# EAGLE schematic Schematic (EAGLE 9.6.2)
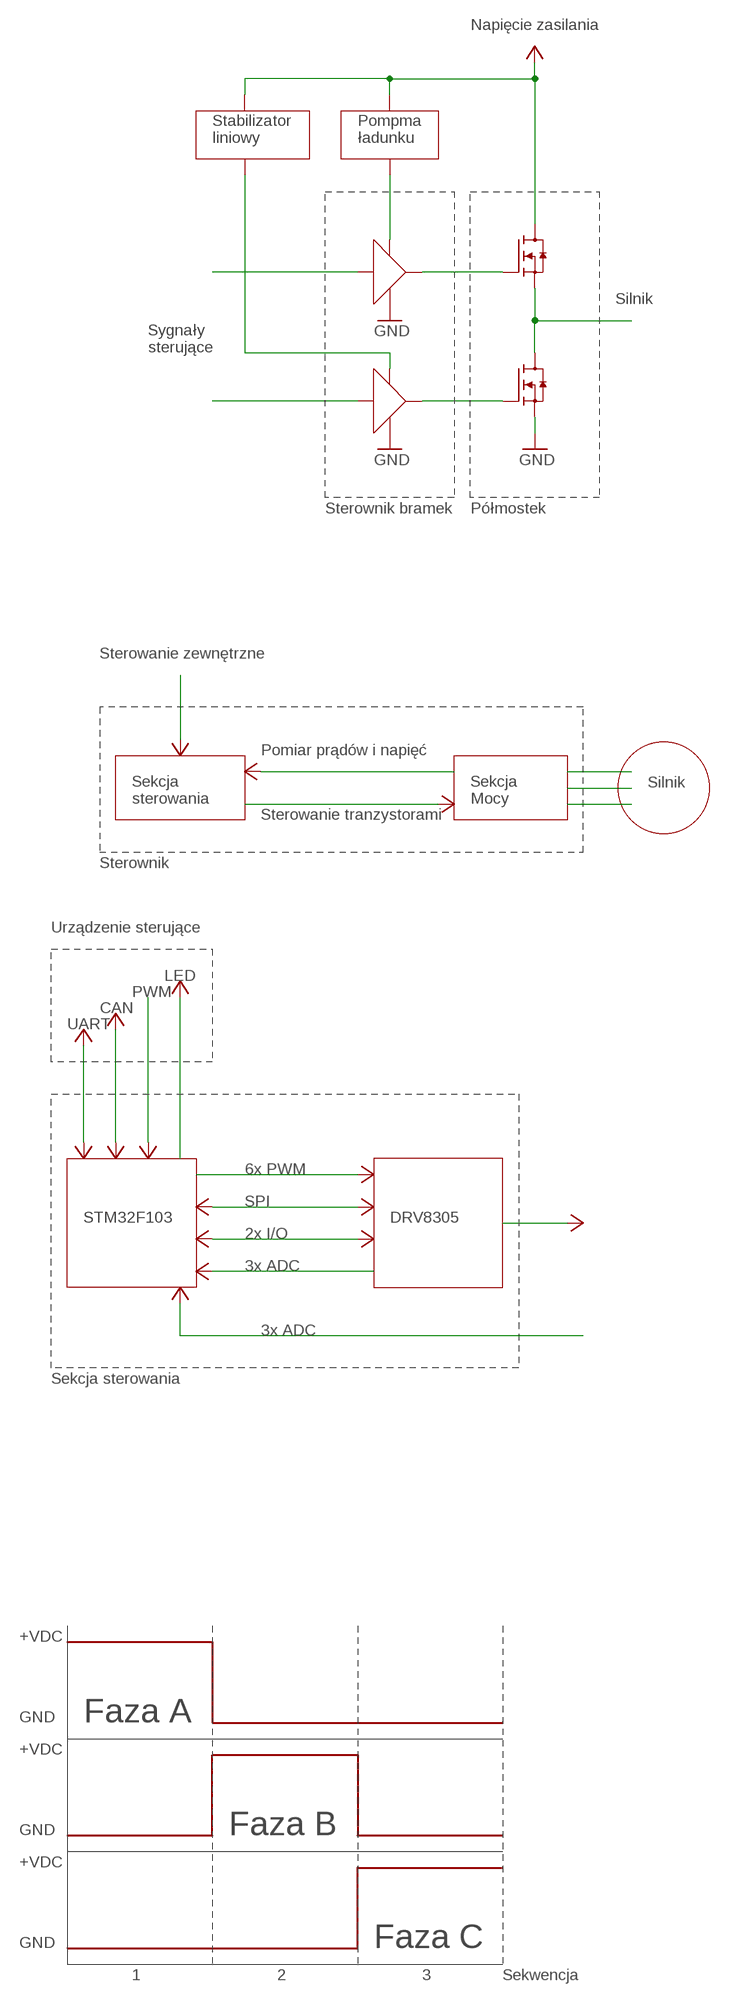
[diagram p0: schematic, sheet 1, part 1 of 3]
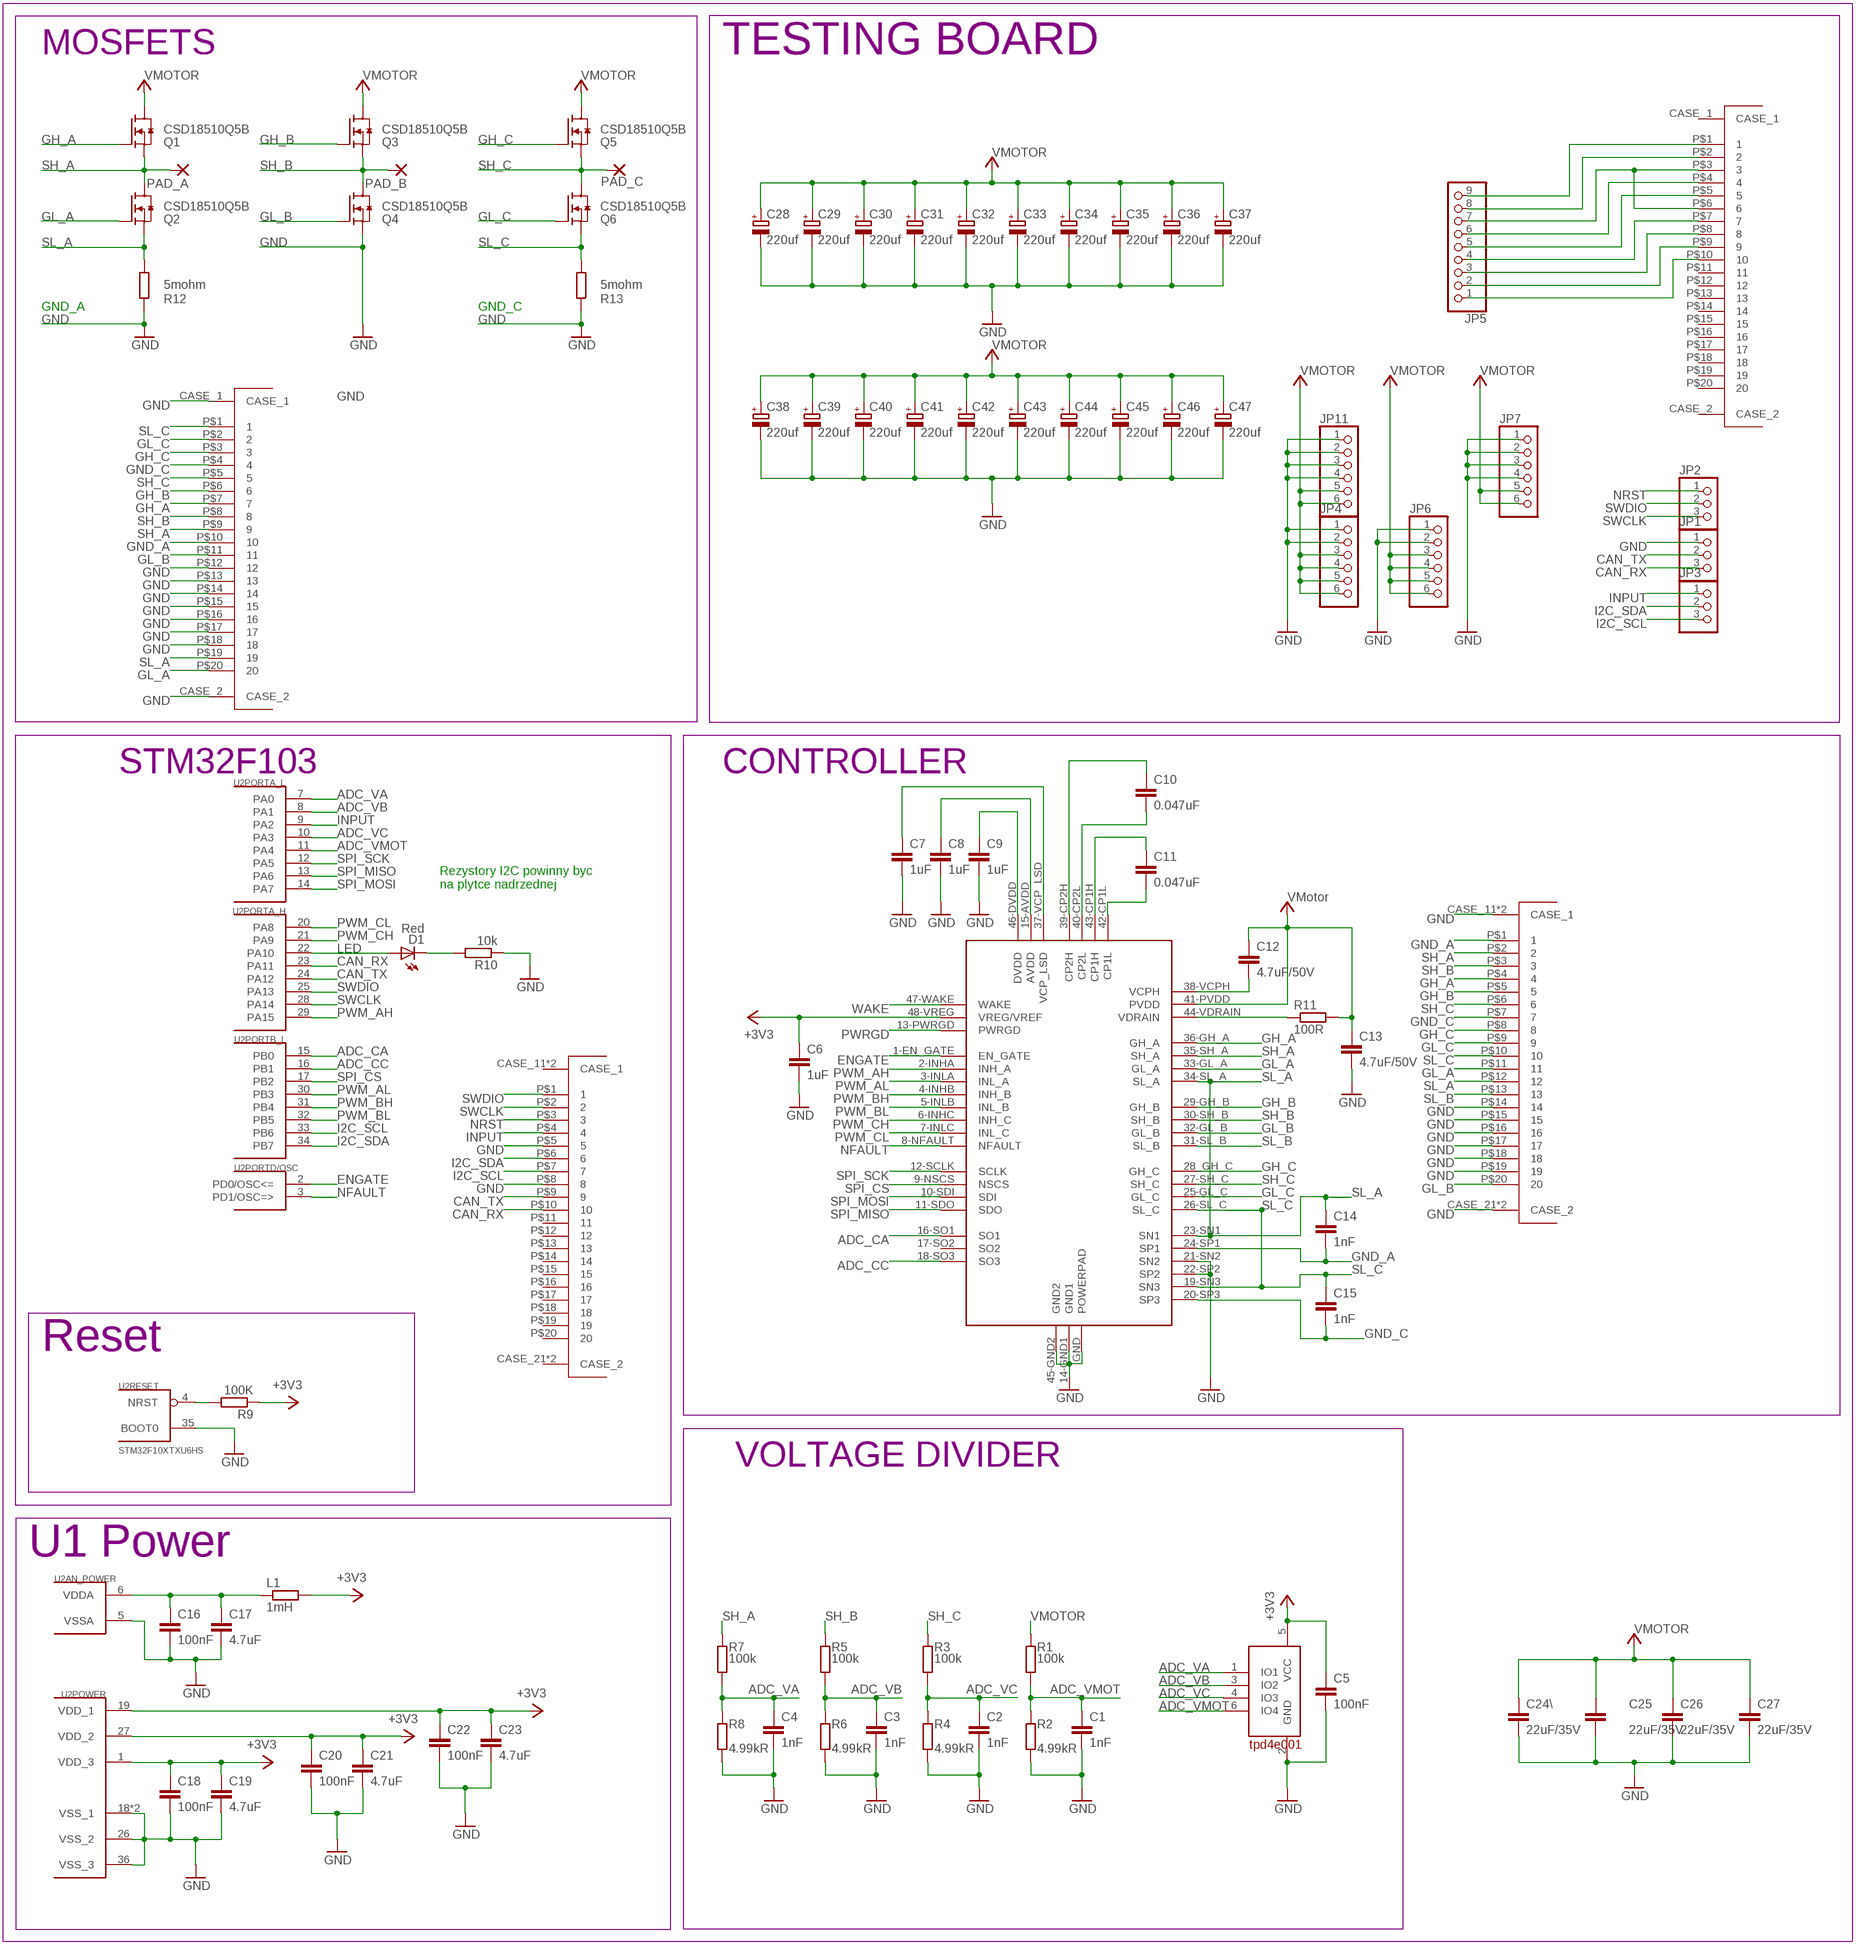
[diagram p1: schematic, sheet 1, part 2 of 3]
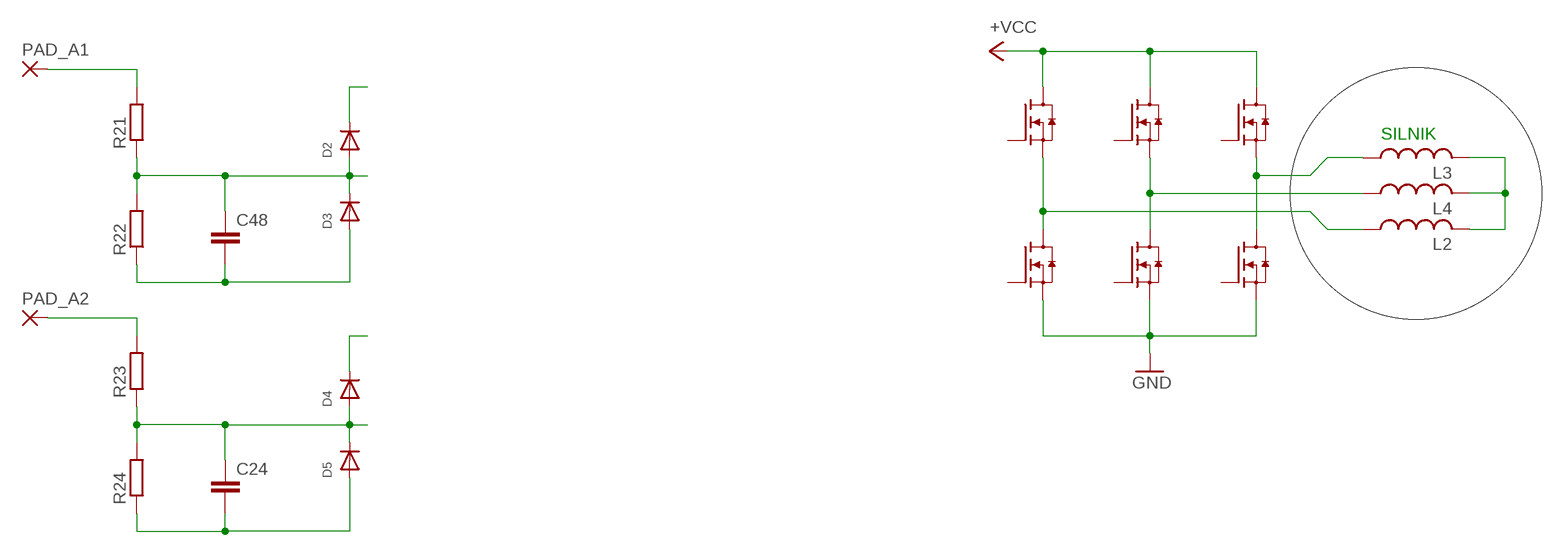
[diagram p2: schematic, sheet 1, part 3 of 3]

## Parts
C1  1nF  C-EU  [R0402]
C2  1nF  C-EU  [R0402]
C3  1nF  C-EU  [R0402]
C4  1nF  C-EU  [R0402]
C5  100nF  C-EU  [R0402]
C6  1uF  C-EU  [R0402]
C7  1uF  C-EU  [R0402]
C8  1uF  C-EU  [R0402]
C9  1uF  C-EU  [R0402]
C10  0.047uF  C-EU  [R0402]
C11  0.047uF  C-EU  [R0402]
C12  4.7uF/50V  C-EUC0805  [C0805]
C13  4.7uF/50V  C-EUC0805  [C0805]
C14  1nF  C-EU  [R0402]
C15  1nF  C-EU  [R0402]
C16  100nF  C-EU  [R0402]
C17  4.7uF  C-EU  [R0402]
C18  100nF  C-EU  [R0402]
C19  4.7uF  C-EU  [R0402]
C20  100nF  C-EU  [R0402]
C21  4.7uF  C-EU  [R0402]
C22  100nF  C-EU  [R0402]
C23  4.7uF  C-EU  [R0402]
C24  C-EU025-040X050  [C025-040X050]
C24\  22uF/35V  C-EUC1206  [C1206]
C25  22uF/35V  C-EUC1206  [C1206]
C26  22uF/35V  C-EUC1206  [C1206]
C27  22uF/35V  C-EUC1206  [C1206]
C28  220uf  CPOL-EU150CLZ-0810  [150CLZ-0810]
C29  220uf  CPOL-EU150CLZ-0810  [150CLZ-0810]
C30  220uf  CPOL-EU150CLZ-0810  [150CLZ-0810]
C31  220uf  CPOL-EU150CLZ-0810  [150CLZ-0810]
C32  220uf  CPOL-EU150CLZ-0810  [150CLZ-0810]
C33  220uf  CPOL-EU150CLZ-0810  [150CLZ-0810]
C34  220uf  CPOL-EU150CLZ-0810  [150CLZ-0810]
C35  220uf  CPOL-EU150CLZ-0810  [150CLZ-0810]
C36  220uf  CPOL-EU150CLZ-0810  [150CLZ-0810]
C37  220uf  CPOL-EU150CLZ-0810  [150CLZ-0810]
C38  220uf  CPOL-EU150CLZ-0810  [150CLZ-0810]
C39  220uf  CPOL-EU150CLZ-0810  [150CLZ-0810]
C40  220uf  CPOL-EU150CLZ-0810  [150CLZ-0810]
C41  220uf  CPOL-EU150CLZ-0810  [150CLZ-0810]
C42  220uf  CPOL-EU150CLZ-0810  [150CLZ-0810]
C43  220uf  CPOL-EU150CLZ-0810  [150CLZ-0810]
C44  220uf  CPOL-EU150CLZ-0810  [150CLZ-0810]
C45  220uf  CPOL-EU150CLZ-0810  [150CLZ-0810]
C46  220uf  CPOL-EU150CLZ-0810  [150CLZ-0810]
C47  220uf  CPOL-EU150CLZ-0810  [150CLZ-0810]
C48  C-EU025-040X050  [C025-040X050]
D1  Red  LEDSML0603  [SML0603]
D2  DIODE_SOD-123FL  [SOD-123FL]
D3  DIODE_SOD-123FL  [SOD-123FL]
D4  DIODE_SOD-123FL  [SOD-123FL]
D5  DIODE_SOD-123FL  [SOD-123FL]
JP1  PINHD-1X3  [1X03]
JP2  PINHD-1X3  [1X03]
JP3  PINHD-1X3  [1X03]
JP4  PINHD-1X6  [1X06]
JP5  PINHD-1X9  [1X09-BIG]
JP6  PINHD-1X6  [1X06]
JP7  PINHD-1X6  [1X06]
JP11  PINHD-1X6  [1X06]
L1  1mH  R-EU_R0603  [R0603]
L2  L-US0204/5  [0204/5]
L3  L-US0204/5  [0204/5]
L4  L-US0204/5  [0204/5]
PAD_A  SMD5  [SMD2,54-5,08]
PAD_A1  SMD5  [SMD2,54-5,08]
PAD_A2  SMD5  [SMD2,54-5,08]
PAD_B  SMD5  [SMD2,54-5,08]
PAD_C  SMD5  [SMD2,54-5,08]
Q1  CSD17573Q5B  [Q5B]
Q2  CSD17573Q5B  [Q5B]
Q3  CSD17573Q5B  [Q5B]
Q4  CSD17573Q5B  [Q5B]
Q5  CSD17573Q5B  [Q5B]
Q6  CSD17573Q5B  [Q5B]
Q7  CSD17573Q5B  [Q5B]
Q8  CSD17573Q5B  [Q5B]
Q9  CSD17573Q5B  [Q5B]
Q10  CSD17573Q5B  [Q5B]
Q11  CSD17573Q5B  [Q5B]
Q12  CSD17573Q5B  [Q5B]
Q13  CSD17573Q5B  [Q5B]
Q14  CSD17573Q5B  [Q5B]
R1  100k  R-EU_R0402  [R0402]
R2  4.99kR  R-EU_R0402  [R0402]
R3  100k  R-EU_R0402  [R0402]
R4  4.99kR  R-EU_R0402  [R0402]
R5  100k  R-EU_R0402  [R0402]
R6  4.99kR  R-EU_R0402  [R0402]
R7  100k  R-EU_R0402  [R0402]
R8  4.99kR  R-EU_R0402  [R0402]
R9  100K  R-EU_R0402  [R0402]
R10  10k  R-EU_R0402  [R0402]
R11  100R  R-EU_R0603  [R0603]
R12  5mohm  R-EU_R2512  [R2512]
R13  5mohm  R-EU_R2512  [R2512]
R21  R-EU_0204/5  [0204/5]
R22  R-EU_0204/5  [0204/5]
R23  R-EU_0204/5  [0204/5]
R24  R-EU_0204/5  [0204/5]
U2  STM32F10XTXU6HS  [VFQFPN36-HS]
U$1  RECEPTACLE_20_0.4_5024262030  [RECEPTACLE_20_0.4_5024262030]
U$2  PLUG_20_0.4_5024302012  [PLUG_20_0.4_5024302012]
U$21  DRV8305  [S-PQFP-G48]
U$30  PLUG_20_0.4_5024302012  [PLUG_20_0.4_5024302012]
U$31  TPD4E001  [SOT-23]
U$32  RECEPTACLE_20_0.4_5024262030  [RECEPTACLE_20_0.4_5024262030]

## Nets
+3V3: C5.1 C6.1 C18.1 C19.1 C20.1 C21.1 C22.1 C23.1 L1.2 R9.1 U2.1(POWER:VDD_3) U2.19(POWER:VDD_1) U2.27(POWER:VDD_2) U$21.48-VREG(VREG/VREF) U$31.5(VCC)
+VCC: Q9.D Q10.D Q11.D ; supply symbol labelled VMotor
ADC_CA: U2.15(PORTB_L:PB0) U$21.16-SO1(SO1)
ADC_CC: U2.16(PORTB_L:PB1) U$21.18-SO3(SO3)
ADC_VA: C4.1 R7.1 R8.2 U2.7(PORTA_L:PA0) U$31.1(IO1)
ADC_VB: C3.1 R5.1 R6.2 U2.8(PORTA_L:PA1) U$31.3(IO2)
ADC_VC: C2.1 R3.1 R4.2 U2.10(PORTA_L:PA3) U$31.4(IO3)
ADC_VMOT: C1.1 R1.1 R2.2 U2.11(PORTA_L:PA4) U$31.6(IO4)
CAN_RX: JP1.3 U2.23(PORTA_H:PA11) U$1.P$10
CAN_TX: JP1.2 U2.24(PORTA_H:PA12) U$1.P$9
ENGATE: U2.2(PORTD/OSC:PD0/OSC<=) U$21.1-EN_GATE(EN_GATE)
GH_A: Q1.G U$21.36-GH_A(GH_A) U$30.P$7 U$32.P$4
GH_B: Q3.G U$21.29-GH_B(GH_B) U$30.P$6 U$32.P$5
GH_C: Q5.G U$21.28_GH_C(GH_C) U$30.P$3 U$32.P$8
GL_A: Q2.G U$21.33-GL_A(GL_A) U$30.P$20 U$32.P$11
GL_B: Q4.G U$21.32-GL_B(GL_B) U$30.P$11 U$32.P$20
GL_C: Q6.G U$21.25-GL_C(GL_C) U$30.P$2 U$32.P$9
GND: C1.2 C2.2 C3.2 C4.2 C5.2 C6.2 C7.2 C8.2 C9.2 C13.2 C16.2 C17.2 C18.2 C19.2 C20.2 C21.2 C22.2 C23.2 C24\.2 C25.2 C26.2 C27.2 C28.- C29.- C30.- C31.- C32.- C33.- C34.- C35.- C36.- C37.- C38.- C39.- C40.- C41.- C42.- C43.- C44.- C45.- C46.- C47.- JP1.1 JP4.1 JP4.2 JP6.1 JP6.2 JP7.1 JP7.2 JP7.3 JP7.4 JP11.1 JP11.2 JP11.3 JP11.4 Q4.S Q8.S Q12.S Q13.S Q14.S R2.1 R4.1 R6.1 R8.1 R10.1 R12.1 R13.1 U2.5(AN_POWER:VSSA) U2.18(POWER:VSS_1) U2.26(POWER:VSS_2) U2.35(RESET:BOOT0) U2.36(POWER:VSS_3) U2.GND(POWER:VSS_1) U$1.P$5 U$1.P$8 U$21.14-GND1(GND1) U$21.21-SN2(SN2) U$21.22-SP2(SP2) U$21.45-GND2(GND2) U$21.GND(POWERPAD) U$30.CASE_1 U$30.CASE_2 U$30.P$12 U$30.P$13 U$30.P$14 U$30.P$15 U$30.P$16 U$30.P$17 U$30.P$18 U$31.2(GND) U$32.CASE_11(CASE_1) U$32.CASE_12(CASE_1) U$32.CASE_21(CASE_2) U$32.CASE_22(CASE_2) U$32.P$14 U$32.P$15 U$32.P$16 U$32.P$17 U$32.P$18 U$32.P$19
GND_A: C14.2 U$21.24-SP1(SP1) U$30.P$10 U$32.P$1
GND_C: C15.2 U$21.20-SP3(SP3) U$30.P$4 U$32.P$7
I2C_SCL: JP3.3 U2.33(PORTB_L:PB6) U$1.P$7
I2C_SDA: JP3.2 U2.34(PORTB_L:PB7) U$1.P$6
INPUT: JP3.1 U2.9(PORTA_L:PA2) U$1.P$4
LED: D1.A U2.22(PORTA_H:PA10)
N$1: JP5.9 U$2.P$1
N$2: C16.1 C17.1 L1.1 U2.6(AN_POWER:VDDA)
N$3: JP5.8 U$2.P$2
N$4: JP5.7 U$2.P$3 U$2.P$6
N$5: JP5.6 U$2.P$4
N$6: JP5.5 U$2.P$5
N$7: JP5.2 U$2.P$9
N$8: JP5.4 U$2.P$7
N$9: JP5.3 U$2.P$8
N$10: C9.1 U$21.46-DVDD(DVDD)
N$11: JP5.1 U$2.P$10
N$12: C8.1 U$21.15-AVDD(AVDD)
N$13: C7.1 U$21.37-VCP_LSD(VCP_LSD)
N$14: C11.2 U$21.42-CP1L(CP1L)
N$15: PAD_A1.1(P) R21.2
N$16: C11.1 U$21.43-CP1H(CP1H)
N$17: C48.1 D2.A D3.C R21.1 R22.2
N$18: C48.2 D3.A R22.1
N$19: PAD_A2.1(P) R23.2
N$20: C10.2 U$21.40-CP2L(CP2L)
N$21: C10.1 U$21.39-CP2H(CP2H)
N$22: R11.1 U$21.44-VDRAIN(VDRAIN)
N$23: C12.2 U$21.38-VCPH(VCPH)
N$24: D2.C
N$25: C24.1 D4.A D5.C R23.1 R24.2
N$26: C24.2 D5.A R24.1
N$27: D4.C
N$29: Q7.S Q8.D
N$31: Q8.G
N$32: Q7.G
N$41: L2.1 Q9.S Q12.D
N$42: L4.1 Q10.S Q13.D
N$43: L3.1 Q11.S Q14.D
N$45: L2.2 L3.2 L4.2
N$81: D1.C R10.2
NFAULT: U2.3(PORTD/OSC:PD1/OSC=>) U$21.8-NFAULT(NFAULT)
NRST: JP2.1 R9.2 U2.4(RESET:NRST) U$1.P$3
PWM_AH: U2.29(PORTA_H:PA15) U$21.2-INHA(INH_A)
PWM_AL: U2.30(PORTB_L:PB3) U$21.3-INLA(INL_A)
PWM_BH: U2.31(PORTB_L:PB4) U$21.4-INHB(INH_B)
PWM_BL: U2.32(PORTB_L:PB5) U$21.5-INLB(INL_B)
PWM_CH: U2.21(PORTA_H:PA9) U$21.6-INHC(INH_C)
PWM_CL: U2.20(PORTA_H:PA8) U$21.7-INLC(INL_C)
PWRGD: U$21.13-PWRGD(PWRGD)
SH_A: PAD_A.1(P) Q1.S Q2.D R7.2 U$21.35-SH_A(SH_A) U$30.P$9 U$32.P$2
SH_B: PAD_B.1(P) Q3.S Q4.D R5.2 U$21.30-SH_B(SH_B) U$30.P$8 U$32.P$3
SH_C: PAD_C.1(P) Q5.S Q6.D R3.2 U$21.27-SH_C(SH_C) U$30.P$5 U$32.P$6
SL_A: C14.1 Q2.S R12.2 U$21.23-SN1(SN1) U$21.34-SL_A(SL_A) U$30.P$19 U$32.P$12
SL_B: U$21.31-SL_B(SL_B) U$32.P$13
SL_C: C15.1 Q6.S R13.2 U$21.19-SN3(SN3) U$21.26-SL_C(SL_C) U$30.P$1 U$32.P$10
SPI_CS: U2.17(PORTB_L:PB2) U$21.9-NSCS(NSCS)
SPI_MISO: U2.13(PORTA_L:PA6) U$21.11-SDO(SDO)
SPI_MOSI: U2.14(PORTA_L:PA7) U$21.10-SDI(SDI)
SPI_SCK: U2.12(PORTA_L:PA5) U$21.12-SCLK(SCLK)
SWCLK: JP2.3 U2.28(PORTA_H:PA14) U$1.P$2
SWDIO: JP2.2 U2.25(PORTA_H:PA13) U$1.P$1
VCC: Q7.D ; supply symbol labelled VMotor
VMOTOR: C12.1 C13.1 C24\.1 C25.1 C26.1 C27.1 C28.+ C29.+ C30.+ C31.+ C32.+ C33.+ C34.+ C35.+ C36.+ C37.+ C38.+ C39.+ C40.+ C41.+ C42.+ C43.+ C44.+ C45.+ C46.+ C47.+ JP4.3 JP4.4 JP4.5 JP4.6 JP6.3 JP6.4 JP6.5 JP6.6 JP7.5 JP7.6 JP11.5 JP11.6 Q1.D Q3.D Q5.D R1.2 R11.2 U$21.41-PVDD(PVDD) ; supply symbol labelled VMotor
WAKE: U$21.47-WAKE(WAKE)
Unconnected: Q9.G Q10.G Q11.G Q12.G Q13.G Q14.G U$1.CASE_11(CASE_1) U$1.CASE_12(CASE_1) U$1.CASE_21(CASE_2) U$1.CASE_22(CASE_2) U$1.P$11 U$1.P$12 U$1.P$13 U$1.P$14 U$1.P$15 U$1.P$16 U$1.P$17 U$1.P$18 U$1.P$19 U$1.P$20 U$2.CASE_1 U$2.CASE_2 U$2.P$11 U$2.P$12 U$2.P$13 U$2.P$14 U$2.P$15 U$2.P$16 U$2.P$17 U$2.P$18 U$2.P$19 U$2.P$20 U$21.17-SO2(SO2)

## Notes on the sheet
- UBER Motor Controller | UBER Motor Controller
- MOSFETS | TESTING BOARD
- CSD18510Q5B | CSD18510Q5B | CSD18510Q5B
- Napięcie zasilania
- CSD18510Q5B | CSD18510Q5B | CSD18510Q5B
- Stabilizator
  liniowy
- Pompma
  ładunku
- GND_A | GND_C
- Silnik
- Sygnały
  sterujące
- Sterownik bramek | Półmostek
- Sterowanie zewnętrzne
- Pomiar prądów i napięć
- Silnik
- Sekcja
  sterowania
- Sekcja
  Mocy
- STM32F103 | CONTROLLER
- Sterowanie tranzystorami
- Sterownik
- Urządzenie sterujące
- Rezystory I2C powinny byc 
  na plytce nadrzednej
- LED
- PWM
- CAN
- UART
- 6x PWM
- SPI
- STM32F103 | DRV8305
- 2x I/O
- 3x ADC
- 3x ADC
- Sekcja sterowania
- Reset
- +VDC
- VOLTAGE DIVIDER
- GND | Faza A
- +VDC
- U1 Power
- GND | Faza B
- +VDC
- GND | Faza C
- 1 | 2 | 3 | Sekwencja
- SILNIK

## Library data of the parts
C1-C11 C14-C23 = rcl:C-EU: CAPACITOR, European symbol
C12 C13 C24 C24\ C25-C27 C48 = rcl:C-EU: CAPACITOR, European symbol; SPICEPREFIX: C
C28-C47 = rcl:CPOL-EU: POLARIZED CAPACITOR, European symbol; SPICEPREFIX: C
D1 = led:LED: LED OSRAM: - CHIPLED LG R971, LG N971, LY N971, LG Q971, LY Q971, LO R971, LY R971 LH N974, LH R974 LS Q976, LO Q976, LY Q976 LO Q996 - Hyper CHIPLED LW Q18S LB Q993, LB Q99A, LB R99A - SideLED LS A670, LO A670, LY A670, LG A670, LP A670 LB A673, LV A673, LT A673, LW A673 LH A674 LY A675 LS A676, LA A676, LO A676, LY A676, LW A676 LS A679, LY A679, LG A679 - Hyper Micro SIDELED® LS Y876, LA Y876, LO Y876, LY Y876 LT Y87S - SmartLED LW L88C, LW L88S LB L89C, LB L89S, LG L890 LS L89K, LO L89K, LY L89K LS L896, LA L896, LO L896, LY L896 - TOPLED LS T670, LO T670, LY T670, LG T670, LP T670 LSG T670, LSP T670, LSY T670, LOP T670, LYG T670 LG T671, LOG T671, LSG T671 LB T673, LV T673, LT T673, LW T673 LH T674 LS T676, LA T676, LO T676, LY T676, LB T676, LH T676, LSB T676, LW T676 LB T67C, LV T67C, LT T67C, LS T67K, LO T67K, LY T67K, LW E67C LS E67B, LA E67B, LO E67B, LY E67B, LB E67C, LV E67C, LT E67C LW T67C LS T679, LY T679, LG T679 LS T770, LO T770, LY T770, LG T770, LP T770 LB T773, LV T773, LT T773, LW T773 LH T774 LS E675, LA E675, LY E675, LS T675 LS T776, LA T776, LO T776, LY T776, LB T776 LHGB T686 LT T68C, LB T68C - Hyper Mini TOPLED® LB M676 - Mini TOPLED Santana® LG M470 LS M47K, LO M47K, LY M47K Source: http://www.osram.convergy.de LUXEON: - LUMILED® LXK2-PW12-R00, LXK2-PW12-S00, LXK2-PW14-U00, LXK2-PW14-V00 LXK2-PM12-R00, LXK2-PM12-S00, LXK2-PM14-U00 LXK2-PE12-Q00, LXK2-PE12-R00, LXK2-PE12-S00, LXK2-PE14-T00, LXK2-PE14-U00 LXK2-PB12-K00, LXK2-PB12-L00, LXK2-PB12-M00, LXK2-PB14-N00, LXK2-PB14-P00, LXK2-PB14-Q00 LXK2-PR12-L00, LXK2-PR12-M00, LXK2-PR14-Q00, LXK2-PR14-R00 LXK2-PD12-Q00, LXK2-PD12-R00, LXK2-PD12-S00 LXK2-PH12-R00, LXK2-PH12-S00 LXK2-PL12-P00, LXK2-PL12-Q00, LXK2-PL12-R00 Source: www.luxeon.com KINGBRIGHT: KA-3528ASYC Source: www.kingbright.com
D2-D5 = adafruit:DIODE: Diode SMADIODE - SMA Surface Mount Package 20V 1A Schottky Diode Digikey: 641-1014-6-ND DO-1N4148 - Through Hole Small Current Diode SOD-123 20V 1 A (.5mV Vf) Schottky Diode - Digikey: MBRX120TPMSCT-ND SOD-323 10V 570mA (.38mV Vf, 3ns) Schottky Diode - Digikey: ZLLS410CT-ND SOD-523 30V 30mA Schottky Diode (RB751S-40TE61) - Digikey: RB751S-40TE61CT-ND SOT23-R/W - SOT23 Package (R = Solder Paste/Reflow Ovens, W = Hand-Soldering) BAT54Film 40V 300mA - Digikey: 497-7162-1-ND
JP1-JP3 = adafruit:PINHD-1X3: PIN HEADER
JP4 JP6 JP7 JP11 = adafruit:PINHD-1X6: PIN HEADER
JP5 = adafruit:PINHD-1X9: Pin header 1x10 0.1" spacing With round pins
L1 R11-R13 = resistor:R-EU_: RESISTOR, European symbol
L2-L4 = rcl:L-US: INDUCTOR, American symbol; SPICEPREFIX: L
PAD_A PAD_A1 PAD_A2 PAD_B PAD_C = wirepad:SMD5: SMD PAD
Q1-Q14 = CSD_Mosfet:CSD17573Q5B
R1-R10 R21-R24 = rcl:R-EU_: RESISTOR, European symbol; SPICEPREFIX: R
U2 = stm32:STM32F10XTXU6: STM32F101/103 36pad VFQPFN36
U$1 U$32 = Molex_2:RECEPTACLE_20_0.4_5024262030
U$2 U$30 = Molex_2:PLUG_20_0.4_5024302012
U$21 = drv8305lbr:DRV8305
U$31 = tpd4e001:TPD4E001